# Altium schematic sheet 9040_fm.SchDoc
size A4
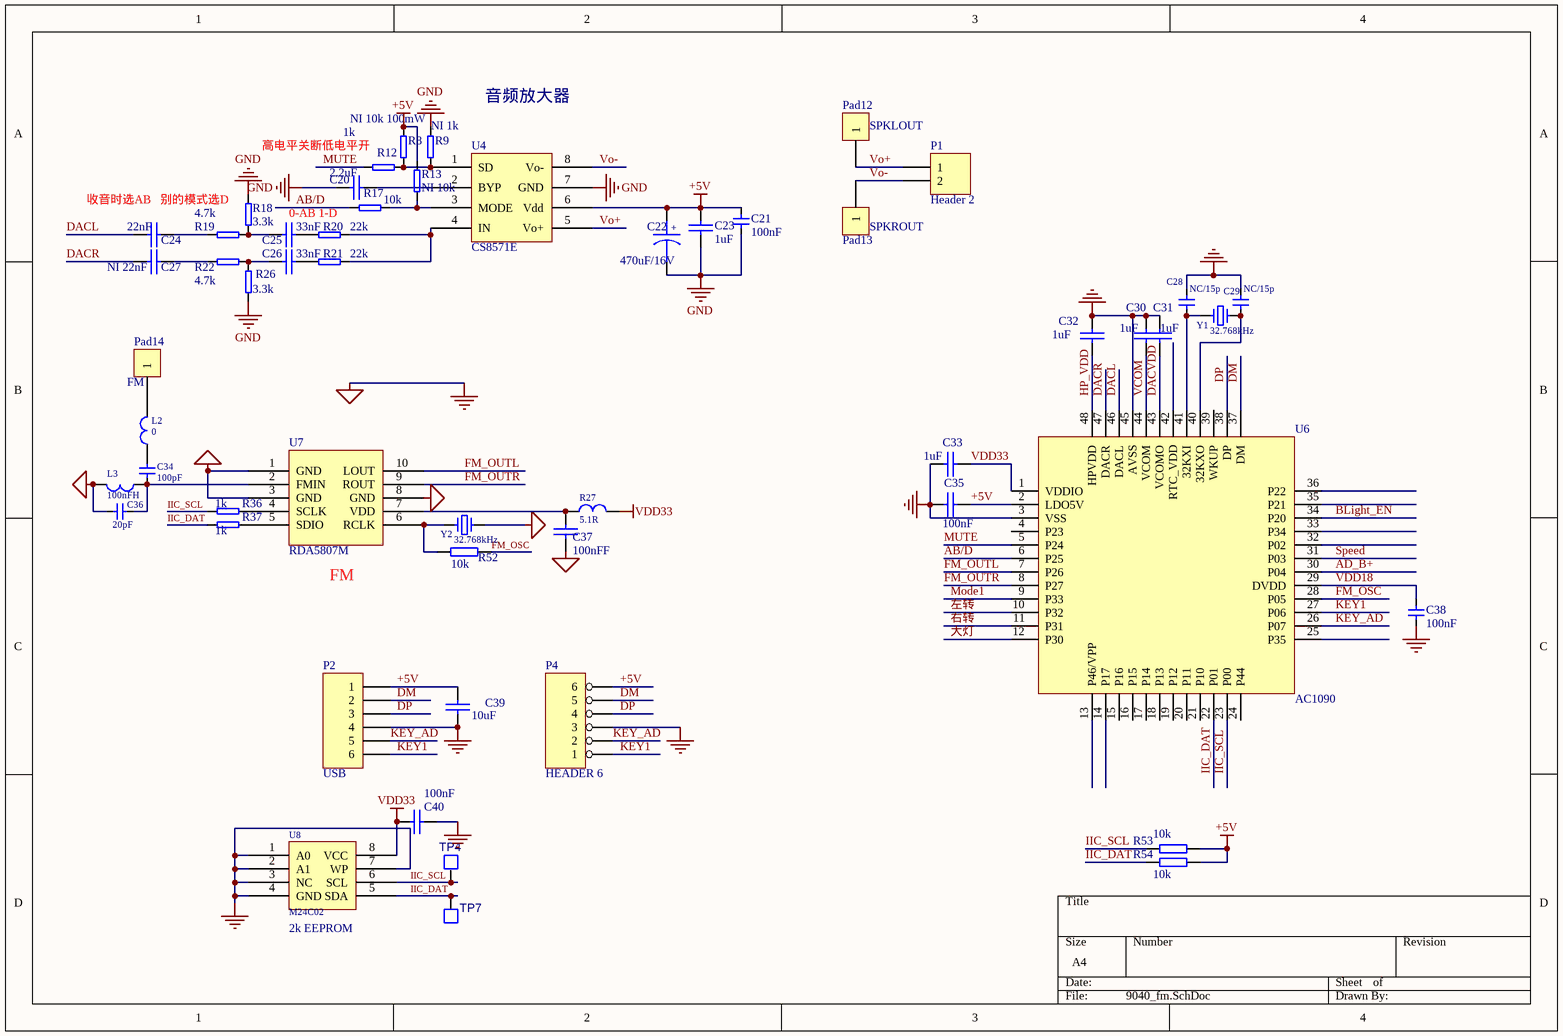
[diagram p0: 9040_fm.SchDoc]

## Parts
C20  2.2uF  [0805]
C21  100nF  [0805]
C22  470uF/16V  [RB.1/.2]
C23  1uF  [0805]
C24  22nF  [0805]
C25  33nF  [0805]
C26  33nF  [0805]
C27  NI 22nF  [0805]
C28  NC/15p  [0603]
C29  NC/15p  [0603]
C30  1uF  [0805]
C31  1uF  [0805]
C32  1uF  [0805]
C33  1uF  [0805]
C34  100pF  [0805]
C35  100nF  [0805]
C36  20pF  [0603]
C37  100nFF  [0805]
C38  100nF  [0603]
C39  10uF  [0805]
C40  100nF  [0805]
L2  0  [0805]
L3  100nFH  [0603]
P1  Header 2  [2543-WV-2PIN]
P2  USB  [FPC-6]
P4  HEADER 6  [HDR1X6]
Pad12  SPKROUT  [PAD]
Pad13  SPKLOUT  [PAD]
Pad14  FM  [PAD]
R8  NI 10k 100mW  [0603]
R9  NI 1k  [0603]
R12  1k  [0603]
R13  NI 10k  [0603]
R17  10k  [0603]
R18  3.3k  [0805]
R19  4.7k  [0805]
R20  22k  [0805]
R21  22k  [0805]
R22  4.7k  [0805]
R26  3.3k  [0805]
R27  5.1R  [0603]
R36  1k  [0603]
R37  1k  [0603]
R52  10k  [0805]
R53  10k  [0603]
R54  10k  [0603]
TP4  TP50MIL  [TP50MIL]  (value not drawn)
TP7  TP50MIL  [TP50MIL]  (value not drawn)
U4  CS8571E  [SO-8]
U6  AC1090  [TQFP48 7X7]
U7  RDA5807M  [MSOP-10]
U8  M24C02  [SO-8]
Y1  32.768kHz  [CRY2060]
Y2  32.768kHz  [CRY2060]

## Nets
+5V: C21.1 C22.1 C23.2 C35.2 C39.1 P2.1 P4.6 R8.2 R13.2 R53.1 R54.1 U4.6(Vdd) U6.2(LDO5V)
AGND: C20.2 C21.2 C22.2 C23.1 C28.2 C29.2 C30.1 C31.1 C32.1 C33.2 C35.1 C36.1 C37.2 C38.2 C39.2 C40.2 L3.2 P2.4 P4.3 R9.2 R18.2 R26.1 U4.7(GND) U6.3(VSS) U6.45(AVSS) U7.1(GND) U7.3(GND) U7.8(GND) U8.1(A0) U8.2(A1) U8.3(NC) U8.4(GND) U8.7(WP) Y2.1  [also labelled GND]
VDD33: C33.1 C40.1 R27.2 U6.1(VDDIO) U8.8(VCC)
AB/D: R17.1 U6.6(P25)
AD_B+: U6.30(P04)
BLight_EN: U6.34(P20)
DACL: C24.2 U6.46(DACL)
DACR: C27.2 U6.47(DACR)
DACVDD: C31.2 U6.43(VCOMO)
DM: P2.2 P4.5 U6.37(DM)
DP: P2.3 P4.4 U6.38(DP)
FM_OSC: R52.1 U6.28(P05)
FM_OUTL: U6.7(P26) U7.10(LOUT)
FM_OUTR: U6.8(P27) U7.9(ROUT)
HP_VDD: C32.2 U6.48(HPVDD)
IIC_DAT: R37.1 R54.2 TP7.1 U6.22(P01) U8.5(SDA)
IIC_SCL: R36.1 R53.2 TP4.1 U6.23(P00) U8.6(SCL)
KEY1: P2.6 P4.1 U6.27(P06)
KEY_AD: P2.5 P4.2 U6.26(P07)
Mode1: U6.9(P33)
MUTE: R12.1 U6.5(P24)
Speed: U6.31(P03)
VCOM: C30.2 U6.44(VCOM)
VDD18: C38.1 U6.29(DVDD)
Vo+: P1.1 Pad12.1 U4.5(Vo+)
Vo-: P1.2 Pad13.1 U4.8(Vo-)
右转: U6.11(P31)
大灯: U6.12(P30)
左转: U6.10(P32)
NetC20_1: C20.1 U4.2(BYP)
NetC24_1: C24.1 R19.1
NetC25_1: C25.1 R20.2
NetC25_2: C25.2 R18.1 R19.2
NetC26_1: C26.1 R21.2
NetC26_2: C26.2 R22.2 R26.2
NetC27_1: C27.1 R22.1
NetC28_1: C28.1 U6.41(32KXI) Y1.2
NetC29_1: C29.1 U6.40(32KXO) Y1.1
NetC34_1: C34.1 C36.2 L3.1 U7.2(FMIN)
NetC34_2: C34.2 L2.1
NetC37_1: C37.1 R27.1 U7.7(VDD)
NetL2_2: L2.2 Pad14.1
NetR8_1: R8.1 R9.1 R12.2 U4.1(SD)
NetR13_1: R13.1 R17.2 U4.3(MODE)
NetR20_1: R20.1 R21.1 U4.4(IN)
NetR36_2: R36.2 U7.4(SCLK)
NetR37_2: R37.2 U7.5(SDIO)
NetR52_2: R52.2 U7.6(RCLK) Y2.2

Not connected (* = marked no-connect by the designer): U6 4(P23) 13(P46/VPP) 14(P17) 15(P16) 16(P15) 17(P14) 18(P13) 19(P12) 20(P11) 21(P10) 24(P44) 25(P35) 32(P02) 33(P34) 35(P21) 36(P22) 39(WKUP) 42(RTC_VDD)

## Notes on the sheet
- 音频放大器
- 高电平关断低电平开
- (near C24) 收音时选AB   别的模式选D
- 0-AB 1-D
- (near U7) FM
- (near U8) 2k EEPROM
- (in symbol CAPACITOR POL) +

## Library data of the parts
C20 C21 C23-C40 = CAP: Capacitor
C22 = CAPACITOR POL: Capacitor
L2 L3 R27 = INDUCTOR
P1 = Header 2: Header, 2-Pin; LatestRevisionDate: 17-Jul-2002; LatestRevisionNote: Re-released for DXP Platform.; Publisher: Altium Limited
P2 = Header 6: Header, 6-Pin; LatestRevisionDate: 17-Jul-2002; LatestRevisionNote: Re-released for DXP Platform.; Publisher: Altium Limited
Pad12-Pad14 = CON1: Connector
R8 R9 R12 R13 R17-R22 R26 R36 R37 = RES2_1
R52-R54 = WHLRES
TP4 TP7 = TP50MIL: 中文名称: 工程测试点; Geometry.Height: 0.1mm; Value: TEST POINT; 物料描述: 工程测试点; PCB DECAL: TP50MIL
U8 = EEPROM-8: brand: ST
Y1 Y2 = CRYSTAL